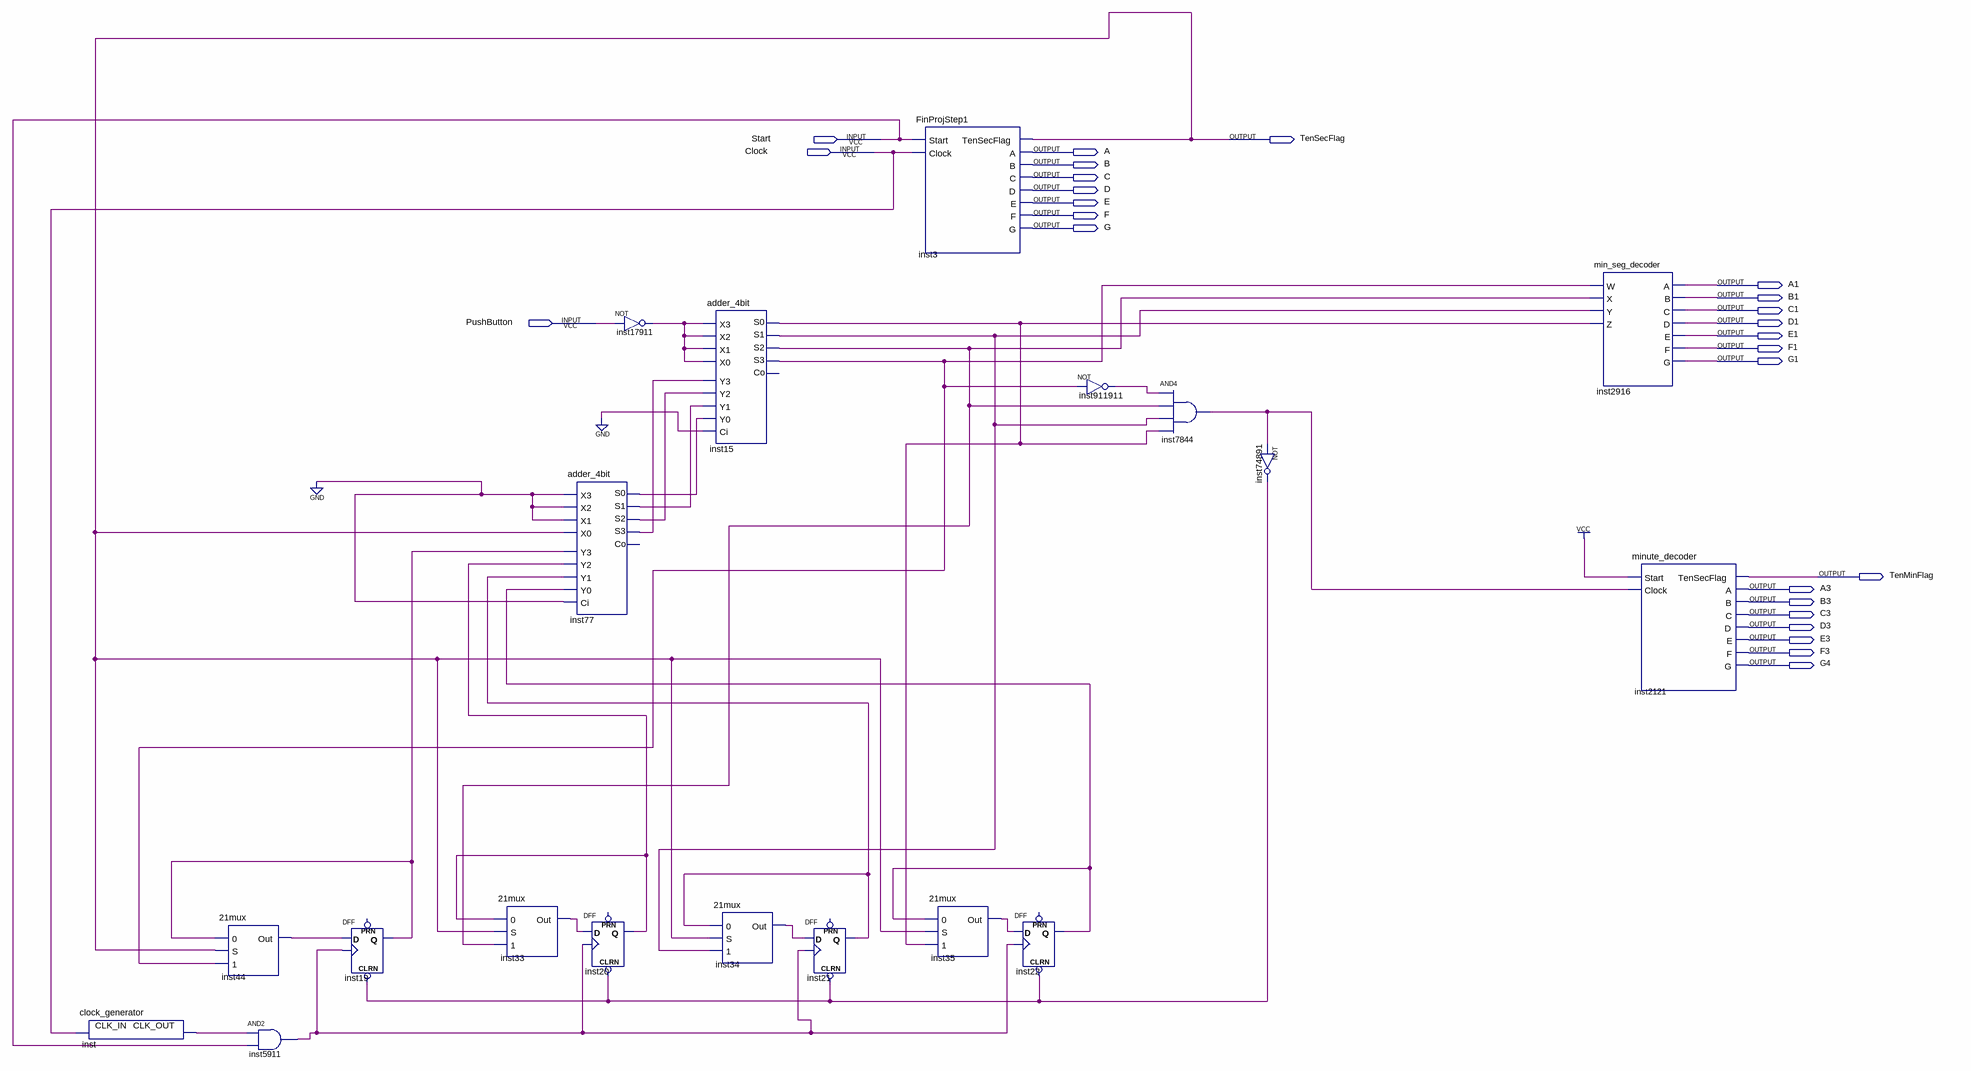
[diagram p0: schematic sheet]
// Quartus schematic FinProjStep2.bdf as structural Verilog: 19 symbols, 26 pins
module FinProjStep2 (
  input  Start,
  input  Clock,
  input  PushButton,
  output TenSecFlag,
  output A,
  output B,
  output C,
  output D,
  output E,
  output F,
  output G,
  output A1,
  output B1,
  output C1,
  output D1,
  output E1,
  output F1,
  output G1,
  output TenMinFlag,
  output A3,
  output B3,
  output C3,
  output D3,
  output E3,
  output F3,
  output G4
);

  wire inst15_s0, inst15_s1, inst15_s2, inst15_s3, inst19_q, inst20_q, inst21_q, inst22_q, inst33_out,
       inst34_out, inst35_out, inst44_out, inst77_s0, inst77_s1, inst77_s2, inst77_s3, inst5911_out,
       inst7844_out, inst17911_out, inst74891_out, inst911911_out, inst_clk_out;

  clock_generator inst (.CLK_IN(Clock), .CLK_OUT(inst_clk_out));
  \21mux  inst44 (.\0 (inst19_q), .S(TenSecFlag), .\1 (inst15_s3), .Out(inst44_out));
  and inst5911 (inst5911_out, inst_clk_out, Start);
  DFF inst19 (.CLRN(inst74891_out), .CLK(inst5911_out), .D(inst44_out), .Q(inst19_q));  // open: PRN
  \21mux  inst33 (.\0 (inst20_q), .S(TenSecFlag), .\1 (inst15_s2), .Out(inst33_out));
  adder_4bit inst77 (
    .X3(1'b0), .Y3(inst19_q), .X2(1'b0), .Y2(inst20_q), .X1(1'b0), .Y1(inst21_q), .X0(TenSecFlag),
    .Y0(inst22_q), .Ci(1'b0), .S0(inst77_s0), .S1(inst77_s1), .S2(inst77_s2), .S3(inst77_s3));  // open: Co
  not inst17911 (inst17911_out, PushButton);
  DFF inst20 (.CLRN(inst74891_out), .CLK(inst5911_out), .D(inst33_out), .Q(inst20_q));  // open: PRN
  adder_4bit inst15 (
    .X3(inst17911_out), .Y3(inst77_s3), .X2(inst17911_out), .Y2(inst77_s2), .X1(inst17911_out),
    .Y1(inst77_s1), .X0(inst17911_out), .Y0(inst77_s0), .Ci(1'b0), .S0(inst15_s0), .S1(inst15_s1),
    .S2(inst15_s2), .S3(inst15_s3));  // open: Co
  \21mux  inst34 (.\0 (inst21_q), .S(TenSecFlag), .\1 (inst15_s1), .Out(inst34_out));
  DFF inst21 (.CLRN(inst74891_out), .CLK(inst5911_out), .D(inst34_out), .Q(inst21_q));  // open: PRN
  FinProjStep1 inst3 (
    .Start(Start), .Clock(Clock), .TenSecFlag(TenSecFlag), .A(A), .B(B), .C(C), .D(D), .E(E), .F(F), .G(G));
  \21mux  inst35 (.\0 (inst22_q), .S(TenSecFlag), .\1 (inst15_s0), .Out(inst35_out));
  DFF inst22 (.CLRN(inst74891_out), .CLK(inst5911_out), .D(inst35_out), .Q(inst22_q));  // open: PRN
  not inst911911 (inst911911_out, inst15_s3);
  and inst7844 (inst7844_out, inst911911_out, inst15_s2, inst15_s1, inst15_s0);
  not inst74891 (inst74891_out, inst7844_out);
  min_seg_decoder inst2916 (
    .W(inst15_s3), .X(inst15_s2), .Y(inst15_s1), .Z(inst15_s0), .A(A1), .B(B1), .C(C1), .D(D1), .E(E1),
    .F(F1), .G(G1));
  minute_decoder inst2121 (
    .Start(1'b1), .Clock(inst7844_out), .TenSecFlag(TenMinFlag), .A(A3), .B(B3), .C(C3), .D(D3), .E(E3),
    .F(F3), .G(G4));
endmodule
